# EAGLE design MAINCONTROL (EAGLE 9.6.2)
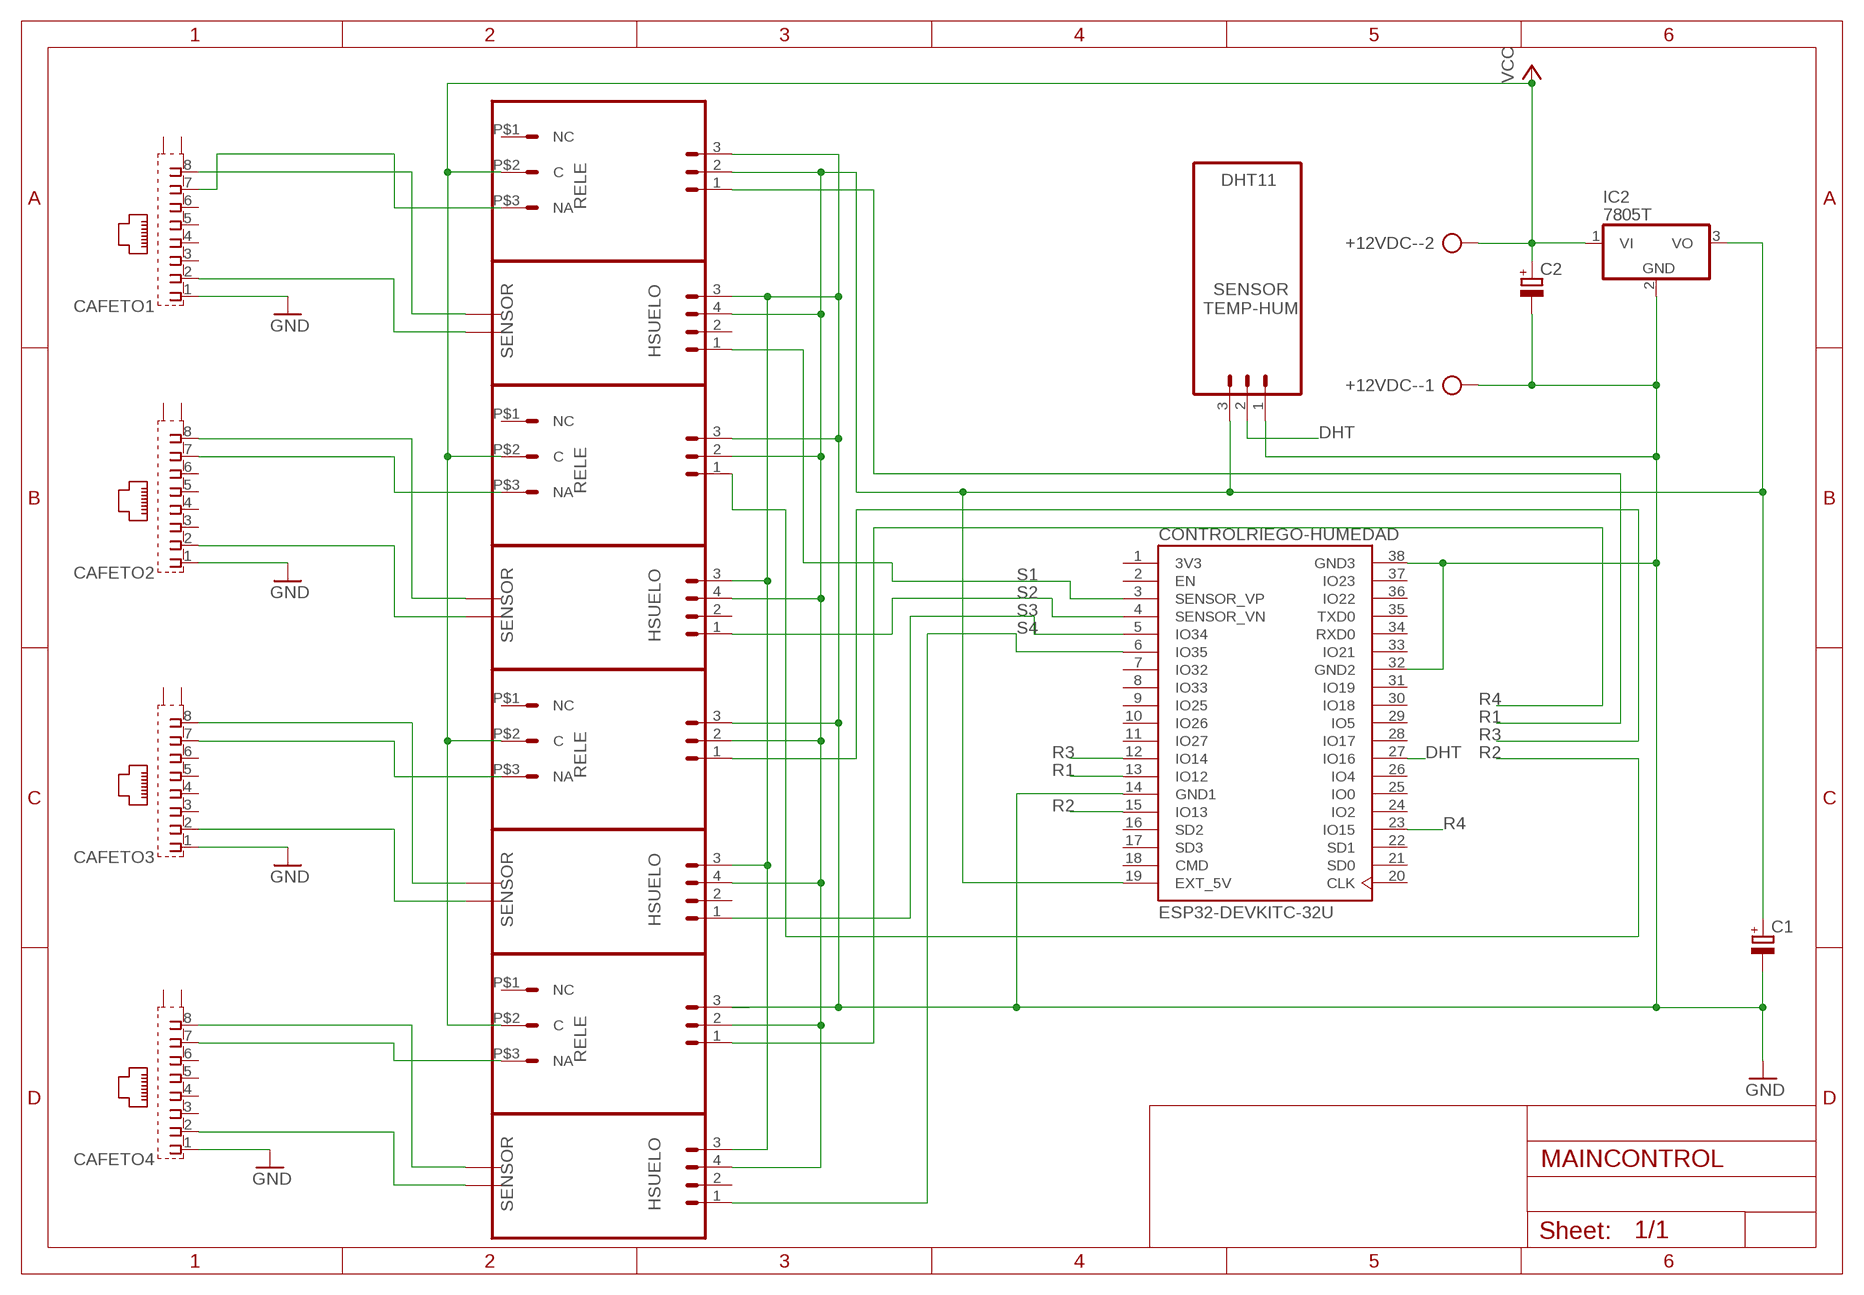
[diagram p0: schematic, sheet 1]

## Parts
+12VDC-  AK500/2-H  [AK500/2-H]
C1  CPOL-EUE2.5-6  [E2,5-6]
C2  CPOL-EUE2,5-6E  [E2,5-6E]
CAFETO1  RJ45-8N3-B  [TE_RJ45-8N3-B]
CAFETO2  RJ45-8N3-B  [TE_RJ45-8N3-B]
CAFETO3  RJ45-8N3-B  [TE_RJ45-8N3-B]
CAFETO4  RJ45-8N3-B  [TE_RJ45-8N3-B]
CONTROLRIEGO-HUMEDAD  ESP32-DEVKITC-32U  [MODULE_ESP32-DEVKITC-32U]
IC2  7805T  [TO220H]
SV1  RELE  [MA03-1]
SV2  DHT11  [DHT11]
SV3  HSUELO  [HSUELO]
SV4  HSUELO  [HSUELO]
SV5  RELE  [MA03-1]
SV6  RELE  [MA03-1]
SV7  RELE  [MA03-1]
SV8  HSUELO  [HSUELO]
SV9  HSUELO  [HSUELO]

## Nets
DHT: CONTROLRIEGO-HUMEDAD.27(IO16) SV2.2
GND: +12VDC-.1 C1.- C2.- CAFETO1.1 CAFETO2.1 CAFETO3.1 CAFETO4.1 CONTROLRIEGO-HUMEDAD.14(GND1) CONTROLRIEGO-HUMEDAD.32(GND2) CONTROLRIEGO-HUMEDAD.38(GND3) IC2.2(GND) SV1.3(GND) SV2.1 SV3.3 SV4.3 SV5.3(GND) SV6.3(GND) SV7.3(GND) SV8.3 SV9.3
N$1: CAFETO1.2 SV8.S2
N$5: CAFETO1.7 SV1.P$3(NA)
N$6: CAFETO2.7 SV5.P$3(NA)
N$8: CAFETO1.8 SV8.S1
N$13: CAFETO2.8 SV4.S1
N$14: CAFETO2.2 SV4.S2
N$15: CAFETO3.8 SV3.S1
N$17: CAFETO3.2 SV3.S2
N$19: CAFETO4.7 SV7.P$3(NA)
N$22: CAFETO3.7 SV6.P$3(NA)
N$23: CAFETO4.8 SV9.S1
N$24: CAFETO4.2 SV9.S2
R1: CONTROLRIEGO-HUMEDAD.13(IO12) SV1.1(S)
R2: CONTROLRIEGO-HUMEDAD.15(IO13) SV5.1(S)
R3: CONTROLRIEGO-HUMEDAD.12(IO14) SV6.1(S)
R4: CONTROLRIEGO-HUMEDAD.23(IO15) SV7.1(S)
S1: CONTROLRIEGO-HUMEDAD.3(SENSOR_VP) SV8.1
S2: CONTROLRIEGO-HUMEDAD.4(SENSOR_VN) SV4.1
S3: CONTROLRIEGO-HUMEDAD.5(IO34) SV3.1
S4: CONTROLRIEGO-HUMEDAD.6(IO35) SV9.1
VCC: +12VDC-.2 C2.+ IC2.1(VI) SV1.P$2(C) SV5.P$2(C) SV6.P$2(C) SV7.P$2(C)
VO: C1.+ CONTROLRIEGO-HUMEDAD.19(EXT_5V) IC2.3(VO) SV1.2(VCC) SV2.3 SV3.4 SV4.4 SV5.2(VCC) SV6.2(VCC) SV7.2(VCC) SV8.4 SV9.4
Unconnected: CAFETO1.3 CAFETO1.4 CAFETO1.5 CAFETO1.6 CAFETO1.9(S1) CAFETO1.10(S2) CAFETO2.3 CAFETO2.4 CAFETO2.5 CAFETO2.6 CAFETO2.9(S1) CAFETO2.10(S2) CAFETO3.3 CAFETO3.4 CAFETO3.5 CAFETO3.6 CAFETO3.9(S1) CAFETO3.10(S2) CAFETO4.3 CAFETO4.4 CAFETO4.5 CAFETO4.6 CAFETO4.9(S1) CAFETO4.10(S2) CONTROLRIEGO-HUMEDAD.2(EN) CONTROLRIEGO-HUMEDAD.7(IO32) CONTROLRIEGO-HUMEDAD.8(IO33) CONTROLRIEGO-HUMEDAD.9(IO25) CONTROLRIEGO-HUMEDAD.10(IO26) CONTROLRIEGO-HUMEDAD.11(IO27) CONTROLRIEGO-HUMEDAD.16(SD2) CONTROLRIEGO-HUMEDAD.17(SD3) CONTROLRIEGO-HUMEDAD.18(CMD) CONTROLRIEGO-HUMEDAD.20(CLK) CONTROLRIEGO-HUMEDAD.21(SD0) CONTROLRIEGO-HUMEDAD.22(SD1) CONTROLRIEGO-HUMEDAD.24(IO2) CONTROLRIEGO-HUMEDAD.25(IO0) CONTROLRIEGO-HUMEDAD.26(IO4) CONTROLRIEGO-HUMEDAD.28(IO17) CONTROLRIEGO-HUMEDAD.29(IO5) CONTROLRIEGO-HUMEDAD.30(IO18) CONTROLRIEGO-HUMEDAD.31(IO19) CONTROLRIEGO-HUMEDAD.33(IO21) CONTROLRIEGO-HUMEDAD.34(RXD0) CONTROLRIEGO-HUMEDAD.35(TXD0) CONTROLRIEGO-HUMEDAD.36(IO22) CONTROLRIEGO-HUMEDAD.37(IO23) SV1.P$1(NC) SV3.2 SV4.2 SV5.P$1(NC) SV6.P$1(NC) SV7.P$1(NC) SV8.2 SV9.2

## Power pins joined to a net without a drawn wire
3V3: CONTROLRIEGO-HUMEDAD.1(3V3)

## Library data of the parts
+12VDC- = con-ptr500:AK500/2-H: CONNECTOR Aug. 2004 / PTR Meßtechnik: Die Bezeichnung der Serie AK505 wurde geändert. Es handelt sich hierbei um AK500 in horizontaler Ausführung.; OC_FARNELL: unknown; OC_NEWARK: unknown
C1 C2 = rcl:CPOL-EU: POLARIZED CAPACITOR, European symbol; SPICEPREFIX: C
CAFETO1-CAFETO4 = RJ45-8N3-B:RJ45-8N3-B: Telecom & Ethernet Connectors 6 TRMN LOW PRFL PCB 8 PIN BLOCK INDUCTOR Check availability <https://pricing.snapeda.com/parts/RJ45-8N3-B/TE%20Connectivity/view-part?ref=eda>; AVAILABILITY: In Stock; CHECK_PRICES: https://www.snapeda.com/parts/RJ45-8N3-B/TE+Connectivity+Corcom+Filters/view-part/?ref=eda; COMMENT: 1-6609212-3; DESCRIPTION: Connector RJ-45 Female 8 Position 2.54mm Solder Right Angle Through Hole 8 Terminal; MF: TE Connectivity; MP: RJ45-8N3-B; PACKAGE: None; PRICE: None; PURCHASE-URL: https://pricing.snapeda.com/search?q=RJ45-8N3-B&ref=eda; SNAPEDA_LINK: https://www.snapeda.com/parts/RJ45-8N3-B/TE+Connectivity+Corcom+Filters/view-part/?ref=snap
CONTROLRIEGO-HUMEDAD = ESP32-DEVKITC-32U:ESP32-DEVKITC-32U: Check availability <https://pricing.snapeda.com/parts/ESP32-DEVKITC-32U/Espressif%20Systems/view-part?ref=eda>; AVAILABILITY: In Stock; CHECK_PRICES: https://www.snapeda.com/parts/ESP32-DEVKITC-32U/Espressif+Systems/view-part/?ref=eda; DESCRIPTION: ESP-WROOM-32 - 802.11 b/g/n (WiFi/WLAN/Wi-Fi 4), Bluetooth® Smart 4.x Low Energy (BLE) RF (Transceiver) 2.4GHz Evaluation Board; MF: Espressif Systems; MP: ESP32-DEVKITC-32U; PACKAGE: CUSTOM-38 ESPRESSIF; PRICE: None; SNAPEDA_LINK: https://www.snapeda.com/parts/ESP32-DEVKITC-32U/Espressif+Systems/view-part/?ref=snap
IC2 = linear:78*: Positive VOLTAGE REGULATOR Source: http://cache.national.com/ds/LM/LM78L05.pdf http://www.fairchildsemi.com/ds/LM/LM7805.pdf
SV1 SV5-SV7 = RELE:RELE: BUZZER; OC_FARNELL: unknown; OC_NEWARK: unknown
SV2 = DHT_HUERTAIOT:DHT11: BUZZER; OC_FARNELL: unknown; OC_NEWARK: unknown
SV3 SV4 SV8 SV9 = HSUELO - copia:HSUELO: PIN HEADER; OC_FARNELL: unknown; OC_NEWARK: unknown

## Board
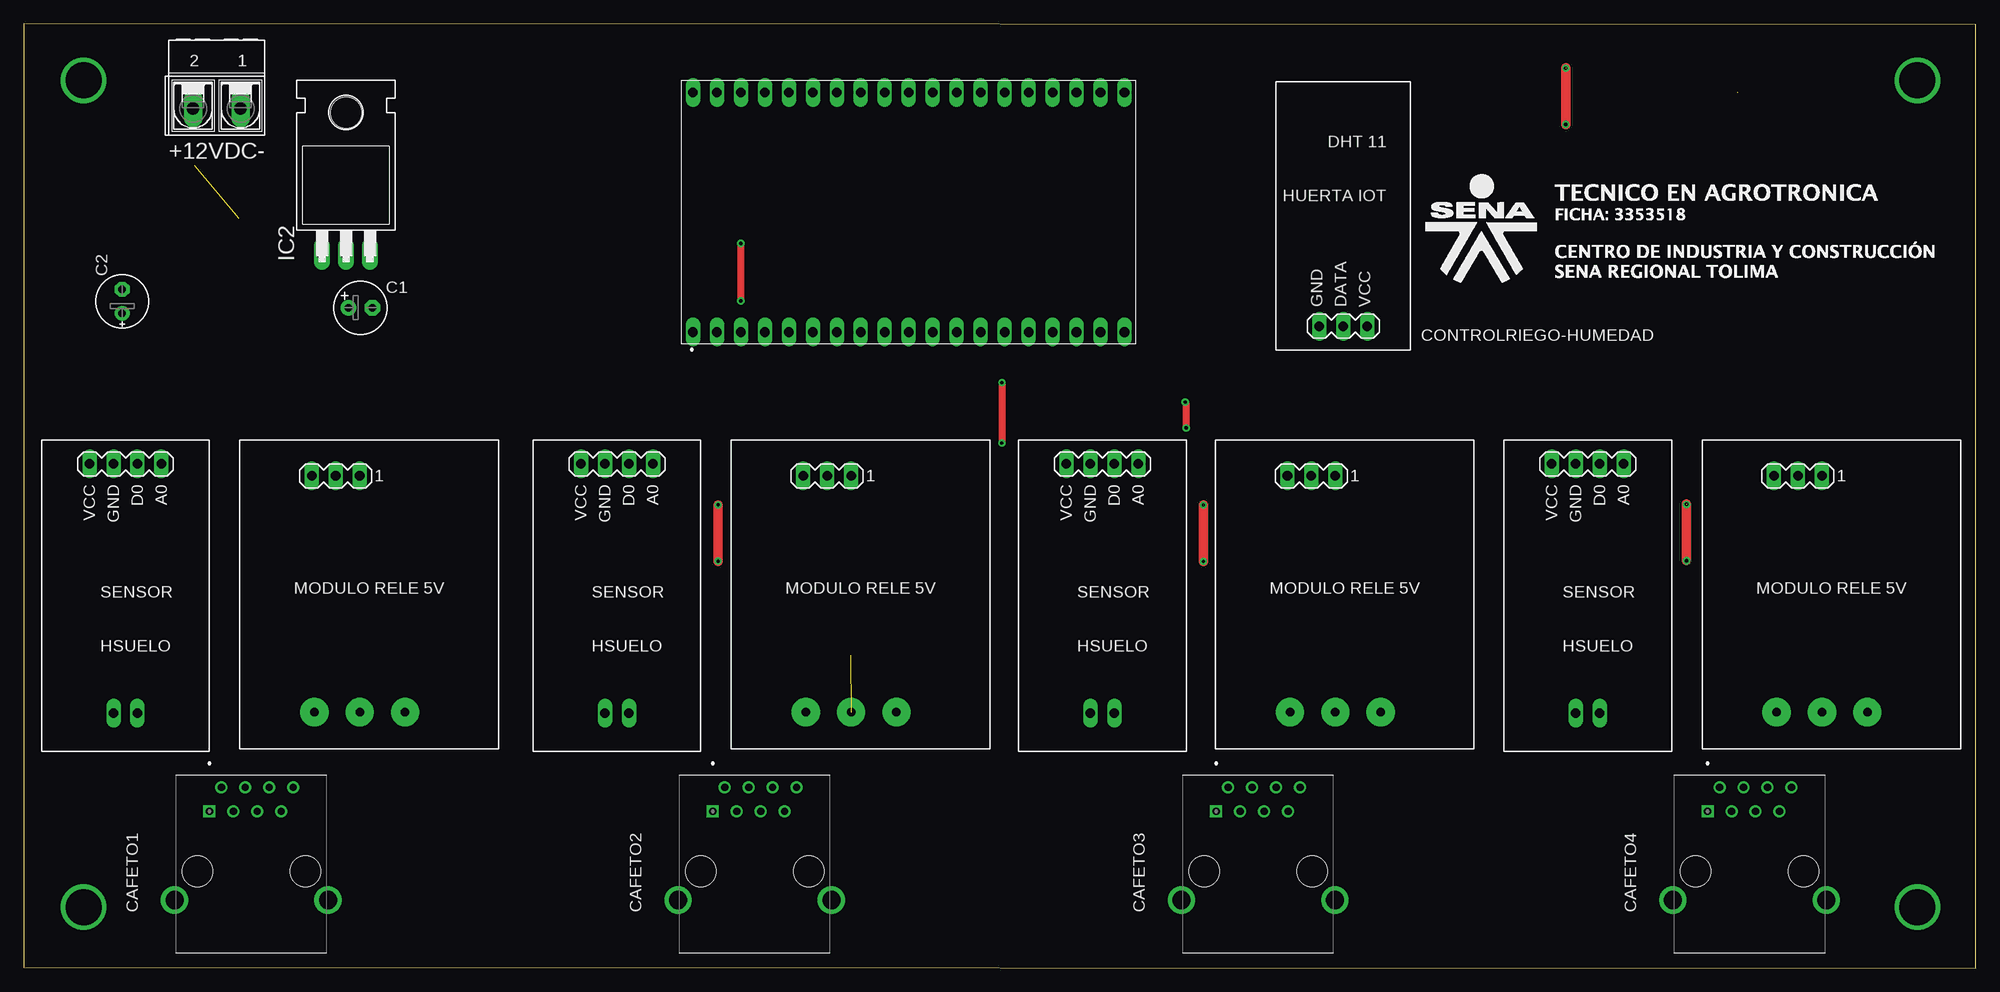
[diagram p1: board, top side]
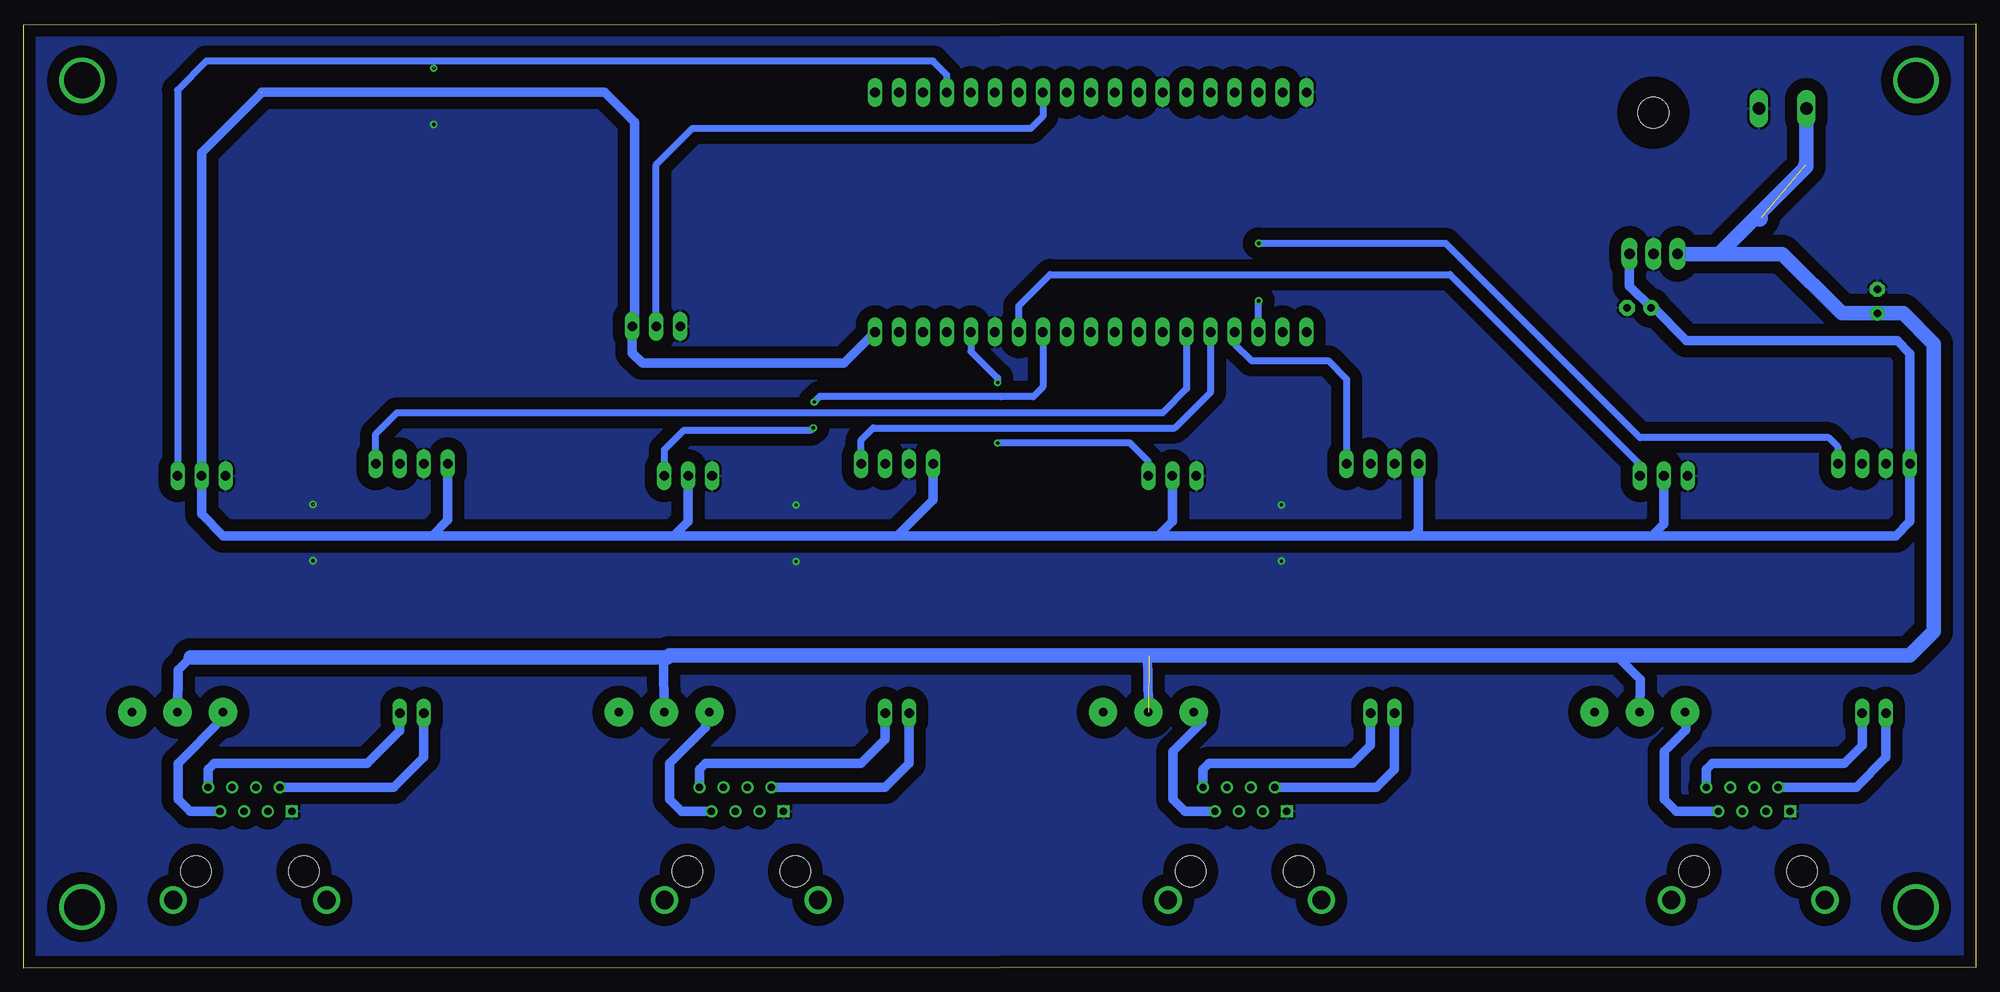
[diagram p2: board, bottom side, seen from below]

Size 206.86 x 100.1 mm. Coordinates in mm from the lower left corner, seen from the top.
Outline: 0,0.1 206.86,0 206.86,100 0,100.1 0,0.1
Copper layers (1*16): Top 0.035mm / dielectric 1.5mm / Bottom 0.035mm
Design rules "default": minimum track width 6mil, minimum drill 0.35mm, track to track 6mil, track to pad 6mil, pad to pad 6mil, via to via 6mil, smd to smd 6mil, copper to edge 40mil, drill to drill 6mil, minimum pad ring 10mil, minimum via ring 8mil, stop-mask expansion 4mil, vias tented up to drill 0mil, thermal gap 10mil

### Footprints (pad centres in the part's own frame; a part is rotated, then mirrored left to right if it is on the bottom)
AK500/2-H = drill 1.321 long: 1 -2.515,0; 2 2.515,0
E2,5-6 = drill 0.813 pad 1.6: + -1.27,0 | drill 0.813 pad 1.6 octagon: - 1.27,0
E2,5-6E = drill 0.813 pad 1.575: + -1.27,0 | drill 0.813 pad 1.575 octagon: - 1.27,0
TE_RJ45-8N3-B = drill 0.762 square: 1 -4.445,0 | drill 0.762: 2 -3.175,2.54; 3 -1.905,0; 4 -0.635,2.54; 5 0.635,0; 7 3.175,0; 8 4.445,2.54 | drill 0.76: 6 1.905,2.54 | drill 1.93: 9 -8.128,-9.398; 10 8.128,-9.398 | hole 3.251: 5.715,-6.35; -5.715,-6.35
MODULE_ESP32-DEVKITC-32U = drill 1.02 long: 1 -12.7,22.85; 2 -12.7,20.31; 3 -12.7,17.77; 4 -12.7,15.23; 5 -12.7,12.69; 6 -12.7,10.15; 7 -12.7,7.61; 8 -12.7,5.07; 9 -12.7,2.53; 10 -12.7,-0.01; 11 -12.7,-2.55; 12 -12.7,-5.09; 13 -12.7,-7.63; 14 -12.7,-10.17; 15 -12.7,-12.71; 16 -12.7,-15.25; 17 -12.7,-17.79; 18 -12.7,-20.33; 19 -12.7,-22.87; 20 12.7,-22.87; 21 12.7,-20.33; 22 12.7,-17.79; 23 12.7,-15.25; 24 12.7,-12.71; 25 12.7,-10.17; 26 12.7,-7.63; 27 12.7,-5.09; 28 12.7,-2.55; 29 12.7,-0.01; 30 12.7,2.53; 31 12.7,5.07; 32 12.7,7.61; 33 12.7,10.15; 34 12.7,12.69; 35 12.7,15.23; 36 12.7,17.77; 37 12.7,20.31; 38 12.7,22.85
TO220H = drill 1.118 long: 1 -2.54,-10.16; 2 0,-10.16; 3 2.54,-10.16 | hole 3.302: 0,4.826
MA03-1 = drill 1.016 long: 1 -1.27,0; 2 1.27,0; 3 3.81,0 | drill 0.9 pad 3: P$1 -6.08,25.05; P$2 -1.27,25.05; P$3 3.54,25.05
DHT11 = drill 1.016 long: 1 -2.54,0; 2 0,0; 3 2.54,0
HSUELO = drill 1.016 long: 1 -3.81,0; 2 -1.27,0; 3 1.27,0; 4 3.81,0; S1 -1.27,26.416; S2 1.27,26.416

### Placement (x,y rotation side)
+12VDC-  20.47,91.08 180 top
C1  35.69,69.98 0 top
C2  10.44,70.66 90 top
CAFETO1  24.13,16.61 0 top
CAFETO2  77.47,16.61 0 top
CAFETO3  130.81,16.61 0 top
CAFETO4  182.88,16.61 0 top
CONTROLRIEGO-HUMEDAD  93.78,80.11 90 top
IC2  34.16,85.85 0 top
SV1  34.34,52.17 180 top
SV2  139.83,68.02 0 top
SV3  114.3,53.44 180 top
SV4  62.87,53.44 180 top
SV5  86.41,52.17 180 top
SV6  137.72,52.17 180 top
SV7  189.28,52.17 180 top
SV8  10.8,53.44 180 top
SV9  165.74,53.44 180 top

### Tracks (layer width: path | path; a pad name or v marks a point on that pad's centre or on a via)
DHT
  Bottom 0.762: SV2.2 139.83,85.17 135.99,89 100.13,89 98.87,90.26 CONTROLRIEGO-HUMEDAD.27
GND  (via drill 0.35)  (3 unrouted)
  Top 1.016: v125.02,43.1 125.02,49.1 | 73.58,43.1 v73.58,43.13 v73.58,49.1 | v176.2,43.18 176.2,49.17 | v163.4,89.41 163.4,95.4
  other vias: 125.02,49.07 176.2,49.15 163.4,95.38
  pour Bottom (isolate 1.27): -7.62,102.97 -7.62,-6.25 207.01,-6.25 213.36,0.1 213.36,100.43 210.82,102.97
N$1
  Bottom 1.016: CAFETO1.2 12.7,19.15 9.52,22.33 SV8.S2
N$5
  Bottom 1.016: SV1.P$3 30.75,25.23 33.02,22.96 33.02,17.88 31.75,16.61 CAFETO1.7
N$6
  Bottom 1.016: SV5.P$3 81.99,26.06 85.09,22.96 85.09,17.88 83.82,16.61 CAFETO2.7
N$7  (via drill 3.81)
  other vias: 6.35,94.08
N$8
  Bottom 1.016: SV8.S1 12.06,23.6 13.97,21.69 27.94,21.69 28.57,21.06 CAFETO1.8
N$9  (via drill 3.81)
  other vias: 6.35,6.45
N$12  (via drill 3.81)
  other vias: 200.66,6.45
N$13
  Bottom 1.016: CAFETO2.8 81.91,21.06 81.28,21.69 66.04,21.69 64.13,23.6 SV4.S1
N$14
  Bottom 1.016: SV4.S2 61.59,21.06 63.5,19.15 CAFETO2.2
N$15
  Bottom 1.016: SV3.S1 115.57,24.23 118.11,21.69 134.62,21.69 135.25,21.06 CAFETO3.8
N$17
  Bottom 1.016: CAFETO3.2 115.57,19.15 113.03,21.69 SV3.S2
N$19
  Bottom 1.016: SV7.P$3 185.69,26.5 190.5,21.69 190.5,17.88 189.23,16.61 CAFETO4.7
N$20  (via drill 3.81)
  other vias: 200.66,94.08
N$22
  Bottom 1.016: SV6.P$3 134.62,26.76 134.62,25.5 138.43,21.69 138.43,17.88 137.16,16.61 CAFETO3.7
N$23
  Bottom 1.016: SV9.S1 167,25.12 170.43,21.69 186.69,21.69 187.32,21.06 CAFETO4.8
N$24
  Bottom 1.016: SV9.S2 164.46,22.33 167.64,19.15 CAFETO4.2
R1
  Bottom 0.762: SV1.1 35.61,53.15 35.81,53.59 55.73,73.51 98.09,73.51 101.41,70.2 CONTROLRIEGO-HUMEDAD.13
R2  (via drill 0.35)
  Top 0.762: v103.66,62.05 v103.66,55.65
  Bottom 0.762: v103.66,62.05 103.66,62.53 106.49,65.36 CONTROLRIEGO-HUMEDAD.15 | SV5.1 87.68,53.7 89.64,55.65 v103.66,55.65
R3  (via drill 0.35)
  Top 0.762: v123.19,57.25 123.14,57.3 123.14,59.94 v123.09,59.99
  Bottom 0.762: v123.19,57.25 123.44,57 136.91,57 138.99,54.91 SV6.1 | v123.09,59.99 122.5,60.58 103.3,60.58 103.28,60.55 99.87,60.55 98.87,61.56 CONTROLRIEGO-HUMEDAD.12
R4
  Bottom 0.762: SV7.1 190.55,93.07 187.5,96.11 110.49,96.11 109.03,94.65 CONTROLRIEGO-HUMEDAD.23
S1  (via drill 0.35)
  Top 0.762: v76,70.71 v76,76.81
  Bottom 0.762: SV8.1 14.6,55.22 15.6,56.21 35.6,56.21 55.94,76.55 56.2,76.81 v76,76.81 | CONTROLRIEGO-HUMEDAD.3 76.01,70.7 v76,70.71
S2
  Bottom 0.762: CONTROLRIEGO-HUMEDAD.4 78.55,66.15 76.76,64.36 68.63,64.36 66.67,62.41 SV4.1
S3
  Bottom 0.762: SV3.1 118.11,55.98 116.84,57.25 84.89,57.25 81.08,61.06 81.09,61.07 CONTROLRIEGO-HUMEDAD.5
S4
  Bottom 0.762: SV9.1 169.54,56.62 167.28,58.88 86.16,58.88 83.63,61.41 CONTROLRIEGO-HUMEDAD.6
VCC  (2 unrouted)
  Bottom 1.016: SV7.P$2 190.5,31.62 189.18,32.94 | SV6.P$2 139.06,32.49 138.61,32.94 138.43,33.12 | 87.78,33.12 87.68,27.88 SV5.P$2 | SV1.P$2 35.56,30.58 38.1,33.12
  Bottom 1.524: 189.18,32.94 138.61,32.94 | 87.63,33.12 138.43,33.12 | 87.78,33.12 38.1,33.12 6.98,33.12 4.44,35.66 4.44,66.14 7.7,69.39 C2.+ 14.22,69.39 20.52,75.69 IC2.1 27.23,75.69 17.96,84.96 17.96,85.22 | 17.96,85.22 18.06,85.12 | 22.78,79.48 22.91,79.35 | +12VDC-.2 17.96,85.22
VO  (1 unrouted)
  Bottom 1.016: 163.58,45.82 161.92,47.47 SV9.4 | 137.97,45.82 163.58,45.82 | SV3.4 110.49,49.63 114.3,45.82 | 114.3,45.82 137.97,45.82 | 34.34,45.82 8.48,45.82 6.98,47.32 SV8.4 6.98,65.15 8.33,66.5 30.66,66.5 34.14,69.98 C1.+ 36.7,72.26 IC2.3 | 34.34,45.82 59.69,45.82 | 59.69,45.82 86.66,45.82 | 86.66,45.82 114.3,45.82 | SV4.4 59.05,46.46 59.69,45.82 | SV1.2 33.07,47.09 34.34,45.82 | SV5.2 85.14,47.35 86.66,45.82 | SV6.2 136.45,47.35 137.97,45.82 | 163.58,45.82 185.72,45.82 188.01,48.11 SV7.2 188.01,86.41 181.64,92.79 | CONTROLRIEGO-HUMEDAD.19 119.95,64.11 141.27,64.11 142.37,65.2 SV2.3 142.11,68.28 142.11,89.64 145.29,92.81 181.61,92.81